# Altium project drive_Project1.PrjPCB
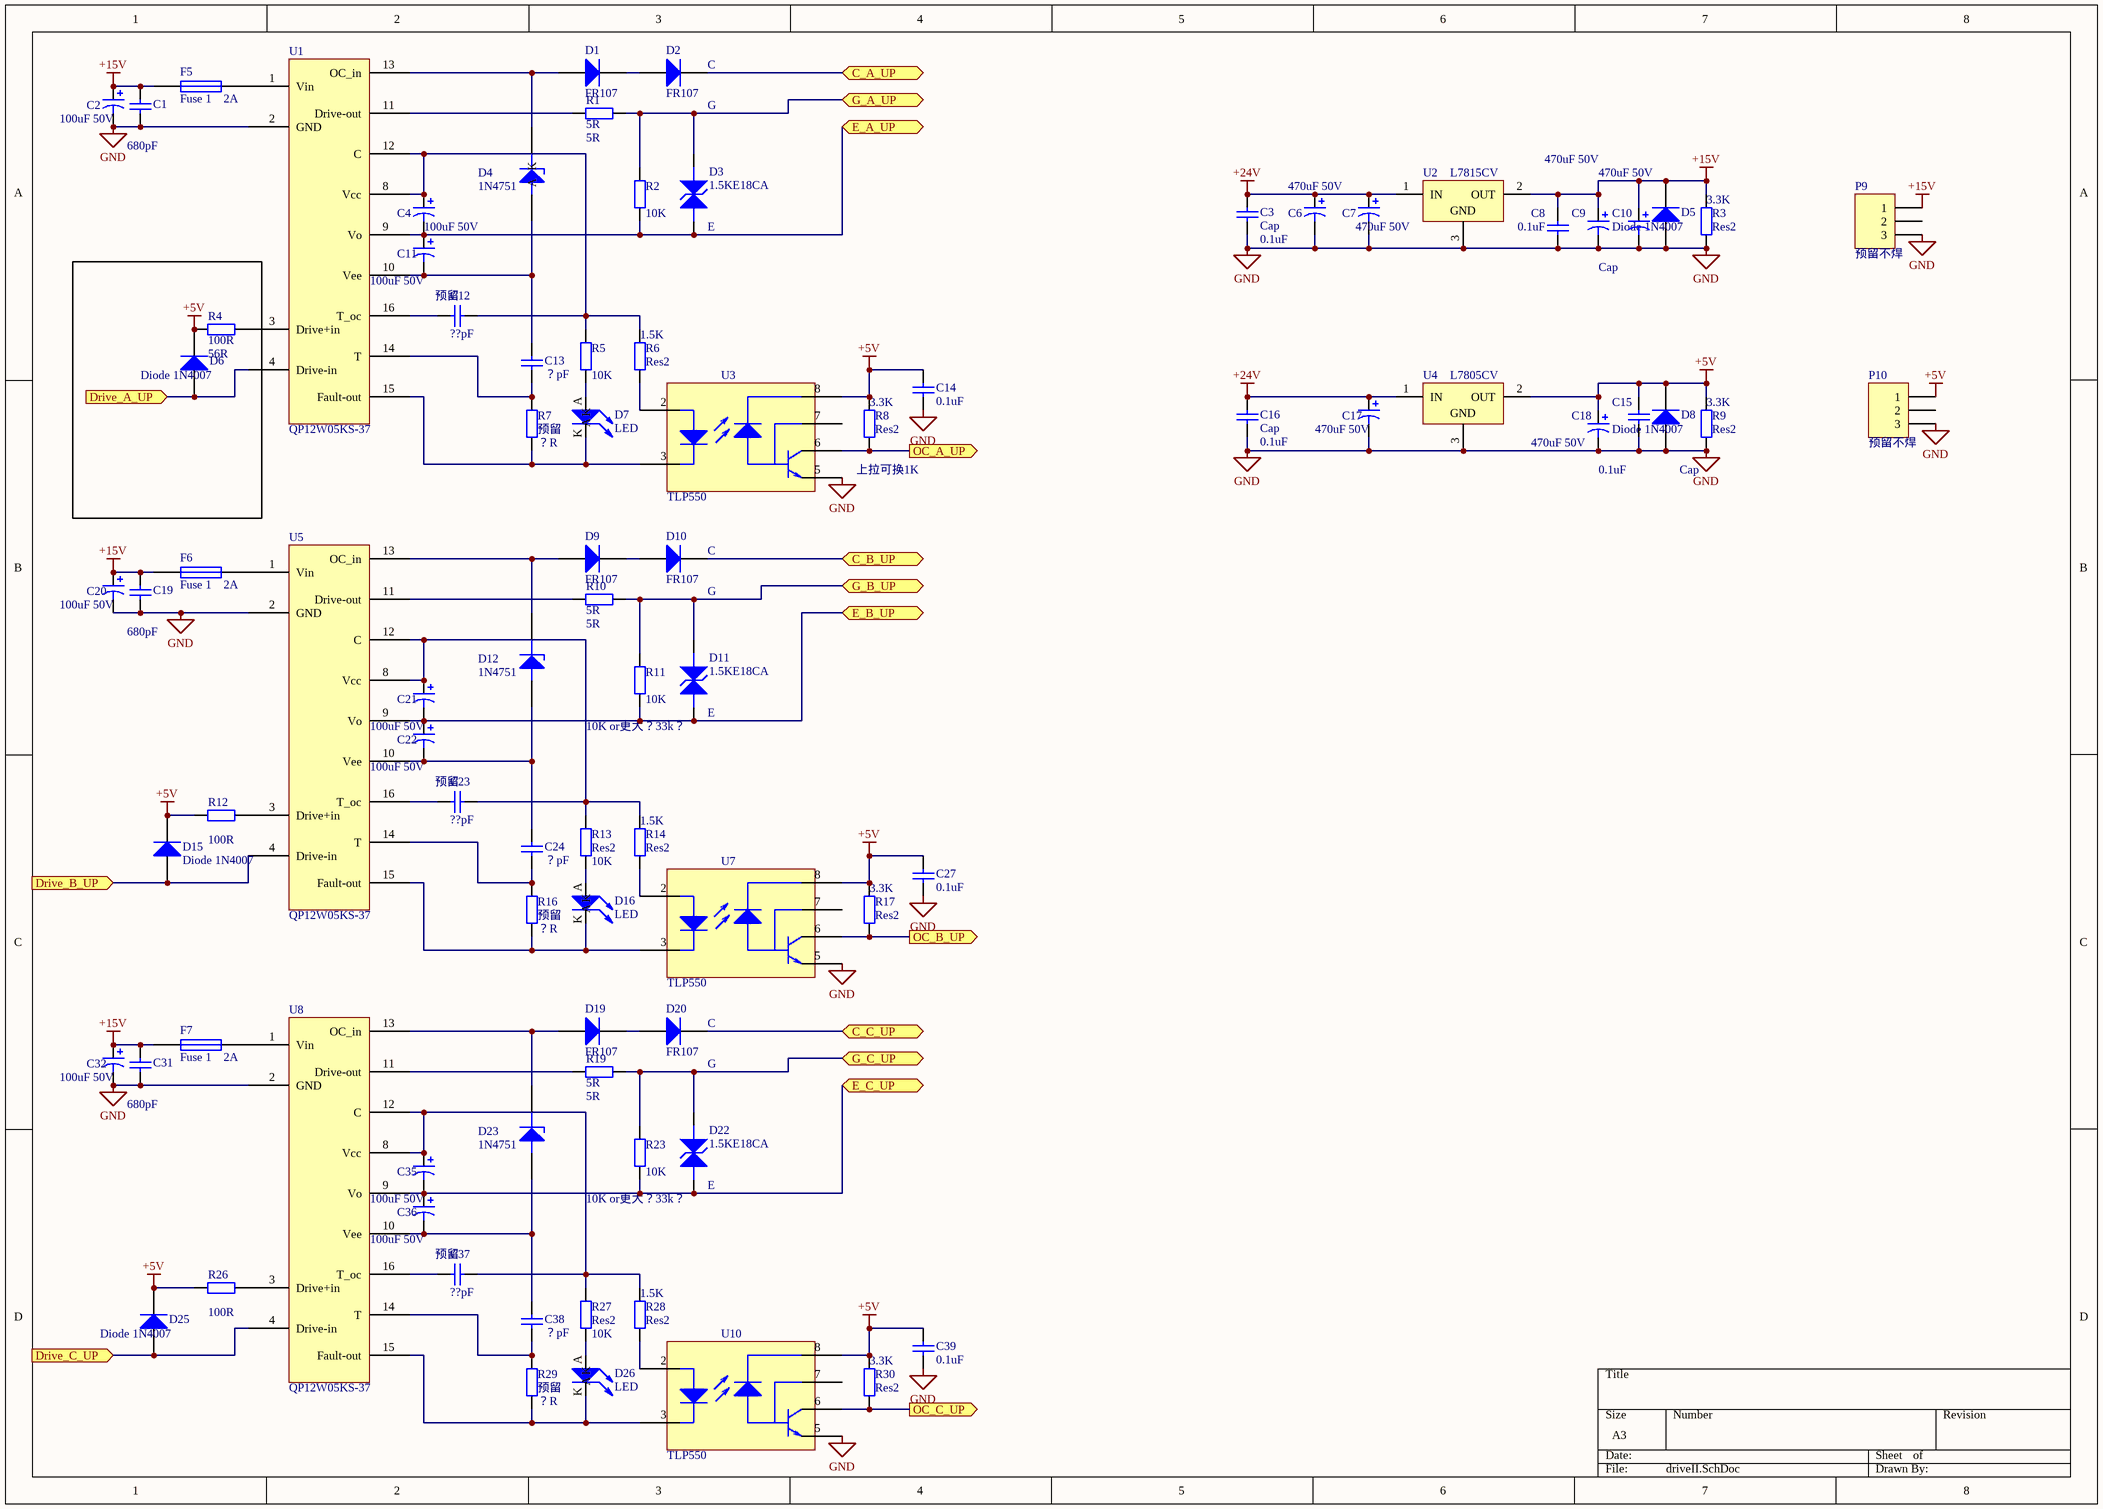
[diagram p0: driveII.SchDoc]
3 sheets, 223 parts. Net scope: flat (ports and power ports of the same name join across sheets).
Board file: PCB2.PcbDoc
Sheets:
  driveII.SchDoc
  driveIII.SchDoc
  main1.SchDoc

## Sheet driveII.SchDoc
size A3

### Parts
C1  value 680pF  [1206]  (hidden comment: Cap)
C2  value 100uF 50V  [电解电容1000uF]  (hidden comment: Cap Pol1)
C3  Cap  value 0.1uF  [1206]
C4  value 100uF 50V  [电解电容1000uF]  (hidden comment: Cap Pol1)
C6  value 470uF 50V  [电解电容470uf]  (hidden comment: Cap Pol1)
C7  value 470uF 50V  [电解电容470uf]  (hidden comment: Cap Pol1)
C8  Cap  value 0.1uF  [1206]
C9  value 470uF 50V  [电解电容470uf]  (hidden comment: Cap Pol1)
C10  value 470uF 50V  [电解电容470uf]  (hidden comment: Cap Pol1)
C11  value 100uF 50V  [电解电容1000uF]  (hidden comment: Cap Pol1)
C12  预留  value ??pF  [1206]
C13  value ？pF  [1206]  (hidden comment: 预留)
C14  value 0.1uF  [1206]  (hidden comment: Cap)
C15  Cap  value 0.1uF  [1206]
C16  Cap  value 0.1uF  [1206]
C17  value 470uF 50V  [电解电容470uf]  (hidden comment: Cap Pol1)
C18  value 470uF 50V  [电解电容470uf]  (hidden comment: Cap Pol1)
C19  value 680pF  [1206]  (hidden comment: Cap)
C20  value 100uF 50V  [电解电容1000uF]  (hidden comment: Cap Pol1)
C21  value 100uF 50V  [电解电容1000uF]  (hidden comment: Cap Pol1)
C22  value 100uF 50V  [电解电容1000uF]  (hidden comment: Cap Pol1)
C23  预留  value ??pF  [1206]
C24  value ？pF  [1206]  (hidden comment: 预留)
C27  value 0.1uF  [1206]  (hidden comment: Cap)
C31  value 680pF  [1206]  (hidden comment: Cap)
C32  value 100uF 50V  [电解电容1000uF]  (hidden comment: Cap Pol1)
C35  value 100uF 50V  [电解电容1000uF]  (hidden comment: Cap Pol1)
C36  value 100uF 50V  [电解电容1000uF]  (hidden comment: Cap Pol1)
C37  预留  value ??pF  [1206]
C38  value ？pF  [1206]  (hidden comment: 预留)
C39  value 0.1uF  [1206]  (hidden comment: Cap)
D1  FR107  [DIODE-0.4]
D2  FR107  [DIODE-0.4]
D3  1.5KE18CA  [AXIAL0.4]
D4  1N4751  [DIODE0.4]
D5  Diode 1N4007  [DIODE0.4]
D6  Diode 1N4007  [DIODE-0.4]
D7  LED  [0805D]
D8  Diode 1N4007  [DIODE0.4]
D9  FR107  [DIODE-0.4]
D10  FR107  [DIODE-0.4]
D11  1.5KE18CA  [AXIAL0.4]
D12  1N4751  [DIODE0.4]
D15  Diode 1N4007  [DIODE-0.4]
D16  LED  [0805D]
D19  FR107  [DIODE-0.4]
D20  FR107  [DIODE-0.4]
D22  1.5KE18CA  [AXIAL0.4]
D23  1N4751  [DIODE0.4]
D25  Diode 1N4007  [DIODE-0.4]
D26  LED  [0805D]
F5  Fuse 1　2A  [CAPR5-4X5]
F6  Fuse 1　2A  [CAPR5-4X5]
F7  Fuse 1　2A  [CAPR5-4X5]
P9  预留不焊  [PHENOX-3]
P10  预留不焊  [PHENOX-3]
R1  5R  [AXIAL0.6]
R2  10K  [AXIAL0.4]
R3  Res2  value 3.3K  [AXIAL0.4]
R4  100R  value 56R  [AXIAL-0.6]
R5  value 10K  [1206]  (hidden comment: Res2)
R6  Res2  value 1.5K  [1206]
R7  预留  value ？R  [1206]
R8  Res2  value 3.3K  [1206]
R9  Res2  value 3.3K  [AXIAL0.4]
R10  5R  [AXIAL0.6]
R11  10K or更大？33k？  value 10K  [AXIAL0.4]
R12  value 100R  [AXIAL-0.6]  (hidden comment: Res2)
R13  Res2  value 10K  [1206]
R14  Res2  value 1.5K  [1206]
R16  预留  value ？R  [1206]
R17  Res2  value 3.3K  [1206]
R19  5R  [AXIAL0.6]
R23  10K or更大？33k？  value 10K  [AXIAL0.4]
R26  value 100R  [AXIAL-0.6]  (hidden comment: Res2)
R27  Res2  value 10K  [1206]
R28  Res2  value 1.5K  [1206]
R29  预留  value ？R  [1206]
R30  Res2  value 3.3K  [1206]
U1  QP12W05KS-37  [QP12W05KS37]
U2  L7815CV  [TO220ABN]
U3  TLP550  [DIP8]
U4  L7805CV  [TO220ABN]
U5  QP12W05KS-37  [QP12W05KS37]
U7  TLP550  [DIP8]
U8  QP12W05KS-37  [QP12W05KS37]
U10  TLP550  [DIP8]

### Ports
C_A_UP, C_B_UP, C_C_UP, Drive_A_UP (in), Drive_B_UP (in), Drive_C_UP (in), E_A_UP, E_B_UP, E_C_UP, G_A_UP, G_B_UP, G_C_UP, OC_A_UP (out), OC_B_UP (out), OC_C_UP (out)

### Nets
+5V: C14.1 C15.2 C18.1 C27.1 C39.1 D6.2(K) D8.K D15.2(K) D25.2(K) P10.1 R4.2 R8.2 R9.2 R12.2 R17.2 R26.2 R30.2 U3.8 U4.2(OUT) U7.8 U10.8
+15V: C1.2 C2.1 C8.2 C9.1 C10.1 C19.2 C20.1 C31.2 C32.1 D5.K F5.1 F6.1 F7.1 P9.1 R3.2 U2.2(OUT)
+24V: C3.2 C6.1 C7.1 C16.2 C17.1 U2.1(IN) U4.1(IN)
GND: C1.1 C2.2 C3.1 C6.2 C7.2 C8.1 C9.2 C10.2 C14.2 C15.1 C16.1 C17.2 C18.2 C19.1 C20.2 C27.2 C31.1 C32.2 C39.2 D5.A D8.A P9.3 P10.3 R3.1 R9.1 U1.2(GND) U2.3(GND) U3.5 U4.3(GND) U5.2(GND) U7.5 U8.2(GND) U10.5
NetC4_1: C4.1 C12.1 R5.2 R6.2 U1.8(Vcc) U1.12(C)
NetC4_2: C4.2 C11.1 D3.1 R2.1 U1.9(Vo) ; port E_A_UP
NetC11_2: C11.2 C13.1 D4.A U1.10(Vee)
NetC12_2: C12.2 U1.16(T_oc)
NetC13_2: C13.2 R7.2 U1.14(T)
NetC21_1: C21.1 C23.1 R13.2 R14.2 U5.8(Vcc) U5.12(C)
NetC21_2: C21.2 C22.1 D11.1 R11.1 U5.9(Vo) ; port E_B_UP
NetC22_2: C22.2 C24.1 D12.A U5.10(Vee)
NetC23_2: C23.2 U5.16(T_oc)
NetC24_2: C24.2 R16.2 U5.14(T)
NetC35_1: C35.1 C37.1 R27.2 R28.2 U8.8(Vcc) U8.12(C)
NetC35_2: C35.2 C36.1 D22.1 R23.1 U8.9(Vo) ; port E_C_UP
NetC36_2: C36.2 C38.1 D23.A U8.10(Vee)
NetC37_2: C37.2 U8.16(T_oc)
NetC38_2: C38.2 R29.2 U8.14(T)
NetC63_2: D2.2(K) D10.2(K) D20.2(K) ; port C_A_UP, port C_B_UP, port C_C_UP
NetCON1_2: D6.1(A) U1.4(Drive-in) ; port Drive_A_UP
NetCON1_6: R8.1 U3.6 ; port OC_A_UP
NetCON1_8: R17.1 U7.6 ; port OC_B_UP
NetCON1_12: R30.1 U10.6 ; port OC_C_UP
NetCON1_18: D15.1(A) U5.4(Drive-in) ; port Drive_B_UP
NetCON1_26: D25.1(A) U8.4(Drive-in) ; port Drive_C_UP
NetD1_1: D1.1(A) D4.K U1.13(OC_in)
NetD1_2: D1.2(K) D2.1(A)
NetD3_2: D3.2 R1.2 R2.2 ; port G_A_UP
NetD7_A: D7.A R5.1
NetD7_K: D7.K R7.1 U1.15(Fault-out) U3.3
NetD9_1: D9.1(A) D12.K U5.13(OC_in)
NetD9_2: D9.2(K) D10.1(A)
NetD11_2: D11.2 R10.2 R11.2 ; port G_B_UP
NetD16_A: D16.A R13.1
NetD16_K: D16.K R16.1 U5.15(Fault-out) U7.3
NetD19_1: D19.1(A) D23.K U8.13(OC_in)
NetD19_2: D19.2(K) D20.1(A)
NetD22_2: D22.2 R19.2 R23.2 ; port G_C_UP
NetD26_A: D26.A R27.1
NetD26_K: D26.K R29.1 U8.15(Fault-out) U10.3
NetF5_2: F5.2 U1.1(Vin)
NetF6_2: F6.2 U5.1(Vin)
NetF7_2: F7.2 U8.1(Vin)
NetR1_1: R1.1 U1.11(Drive-out)
NetR4_1: R4.1 U1.3(Drive+in)
NetR6_1: R6.1 U3.2
NetR10_1: R10.1 U5.11(Drive-out)
NetR12_1: R12.1 U5.3(Drive+in)
NetR14_1: R14.1 U7.2
NetR19_1: R19.1 U8.11(Drive-out)
NetR26_1: R26.1 U8.3(Drive+in)
NetR28_1: R28.1 U10.2

Not connected (* = marked no-connect by the designer): P9 2; P10 2; U3 7; U7 7; U10 7

### Notes on the sheet
- (near D2) C
- G
- (near D3) E
- (near R8) 上拉可换1K
- (near D10) C
- (near D11) E
- (near D20) C
- (near D22) E

### Library data of the parts
C1 C3 C8 C13-C16 C19 C24 C27 C31 C38 C39 = Cap: Capacitor; Published: 8-Jun-2000; LatestRevisionDate: 17-Jul-2002; LatestRevisionNote: Re-released for DXP Platform.; PackageReference: RAD-0.3; Publisher: Altium Limited
C2 C4 C6 C7 C9-C11 C17 C18 C20-C22 C32 C35 C36 = Cap Pol1: Polarized Capacitor (Radial); Published: 8-Jun-2000; LatestRevisionDate: 17-Jul-2002; LatestRevisionNote: Re-released for DXP Platform.; PackageReference: RB7.6-15; Publisher: Altium Limited
C12 C23 C37 = Cap: Published: 8-Jun-2000; LatestRevisionDate: 17-Jul-2002; LatestRevisionNote: Re-released for DXP Platform.; PackageReference: RAD-0.3; Publisher: Altium Limited
D1 D2 D5 D6 D8-D10 D15 D19 D20 D25 = Diode 1N4148: High Conductance Fast Diode; Published: 8-Jun-2000; LatestRevisionDate: 17-Jul-2002; LatestRevisionNote: Re-released for DXP Platform.; DatasheetVersion: 1997; PackageReference: DO-35; Publisher: Altium Limited; Code_JEDEC: DO-204-AH; ComponentLink1Description: Manufacturer Link; ComponentLink1URL: http://www.fairchildsemi.com/; ComponentLink2Description: Datasheet; ComponentLink2URL: http://www.fairchildsemi.com/ds/1N%2F1N4148.pdf
D3 D11 D22 = D-SMBJ5.0CA: TVS 18V
D4 D12 D23 = ZENER1: Zener Diode 30V
D7 D16 D26 = DIODE1
F5-F7 = Fuse 1: Fuse; Published: 8-Jun-2000; LatestRevisionDate: 17-Jul-2002; LatestRevisionNote: Re-released for DXP Platform.; PackageReference: PIN-W2/E2.8; Publisher: Altium Limited
P9 P10 = Header 3: Header, 3-Pin; LatestRevisionDate: 17-Jul-2002; LatestRevisionNote: Re-released for DXP Platform.; Publisher: Altium Limited
R1-R14 R16 R17 R19 R23 R26-R30 = Res2: Resistor; Published: 8-Jun-2000; LatestRevisionDate: 17-Jul-2002; LatestRevisionNote: Re-released for DXP Platform.; PackageReference: AXIAL-0.4; Publisher: Altium Limited
  R1 R10 R19: Value: 5R
  R2: Value: 10K
U2 U4 = L7815CV: Positive Voltage Regulator; Note: Tab is connected to pin 3 (GND).; Published: 24-Aug-2001; LatestRevisionDate: 17-Jul-2002; LatestRevisionNote: Re-released for DXP Platform.; DatasheetVersion: Dec-1998; PackageVersion: Jun-1998; PackageReference: TO220ABN; Publisher: Altium Limited; PackageDescription: TO, Thru-Hole, Vertical, Heatsink Mounted; 3 In-Line Leads; Pitch 2.54 mm; Pin sequence 1, 3, 2; ComponentLink1Description: Manufacturer Link; ComponentLink1URL: http://www.st.com/
U3 U7 U10 = HCPL4053

## Sheet driveIII.SchDoc
size A3
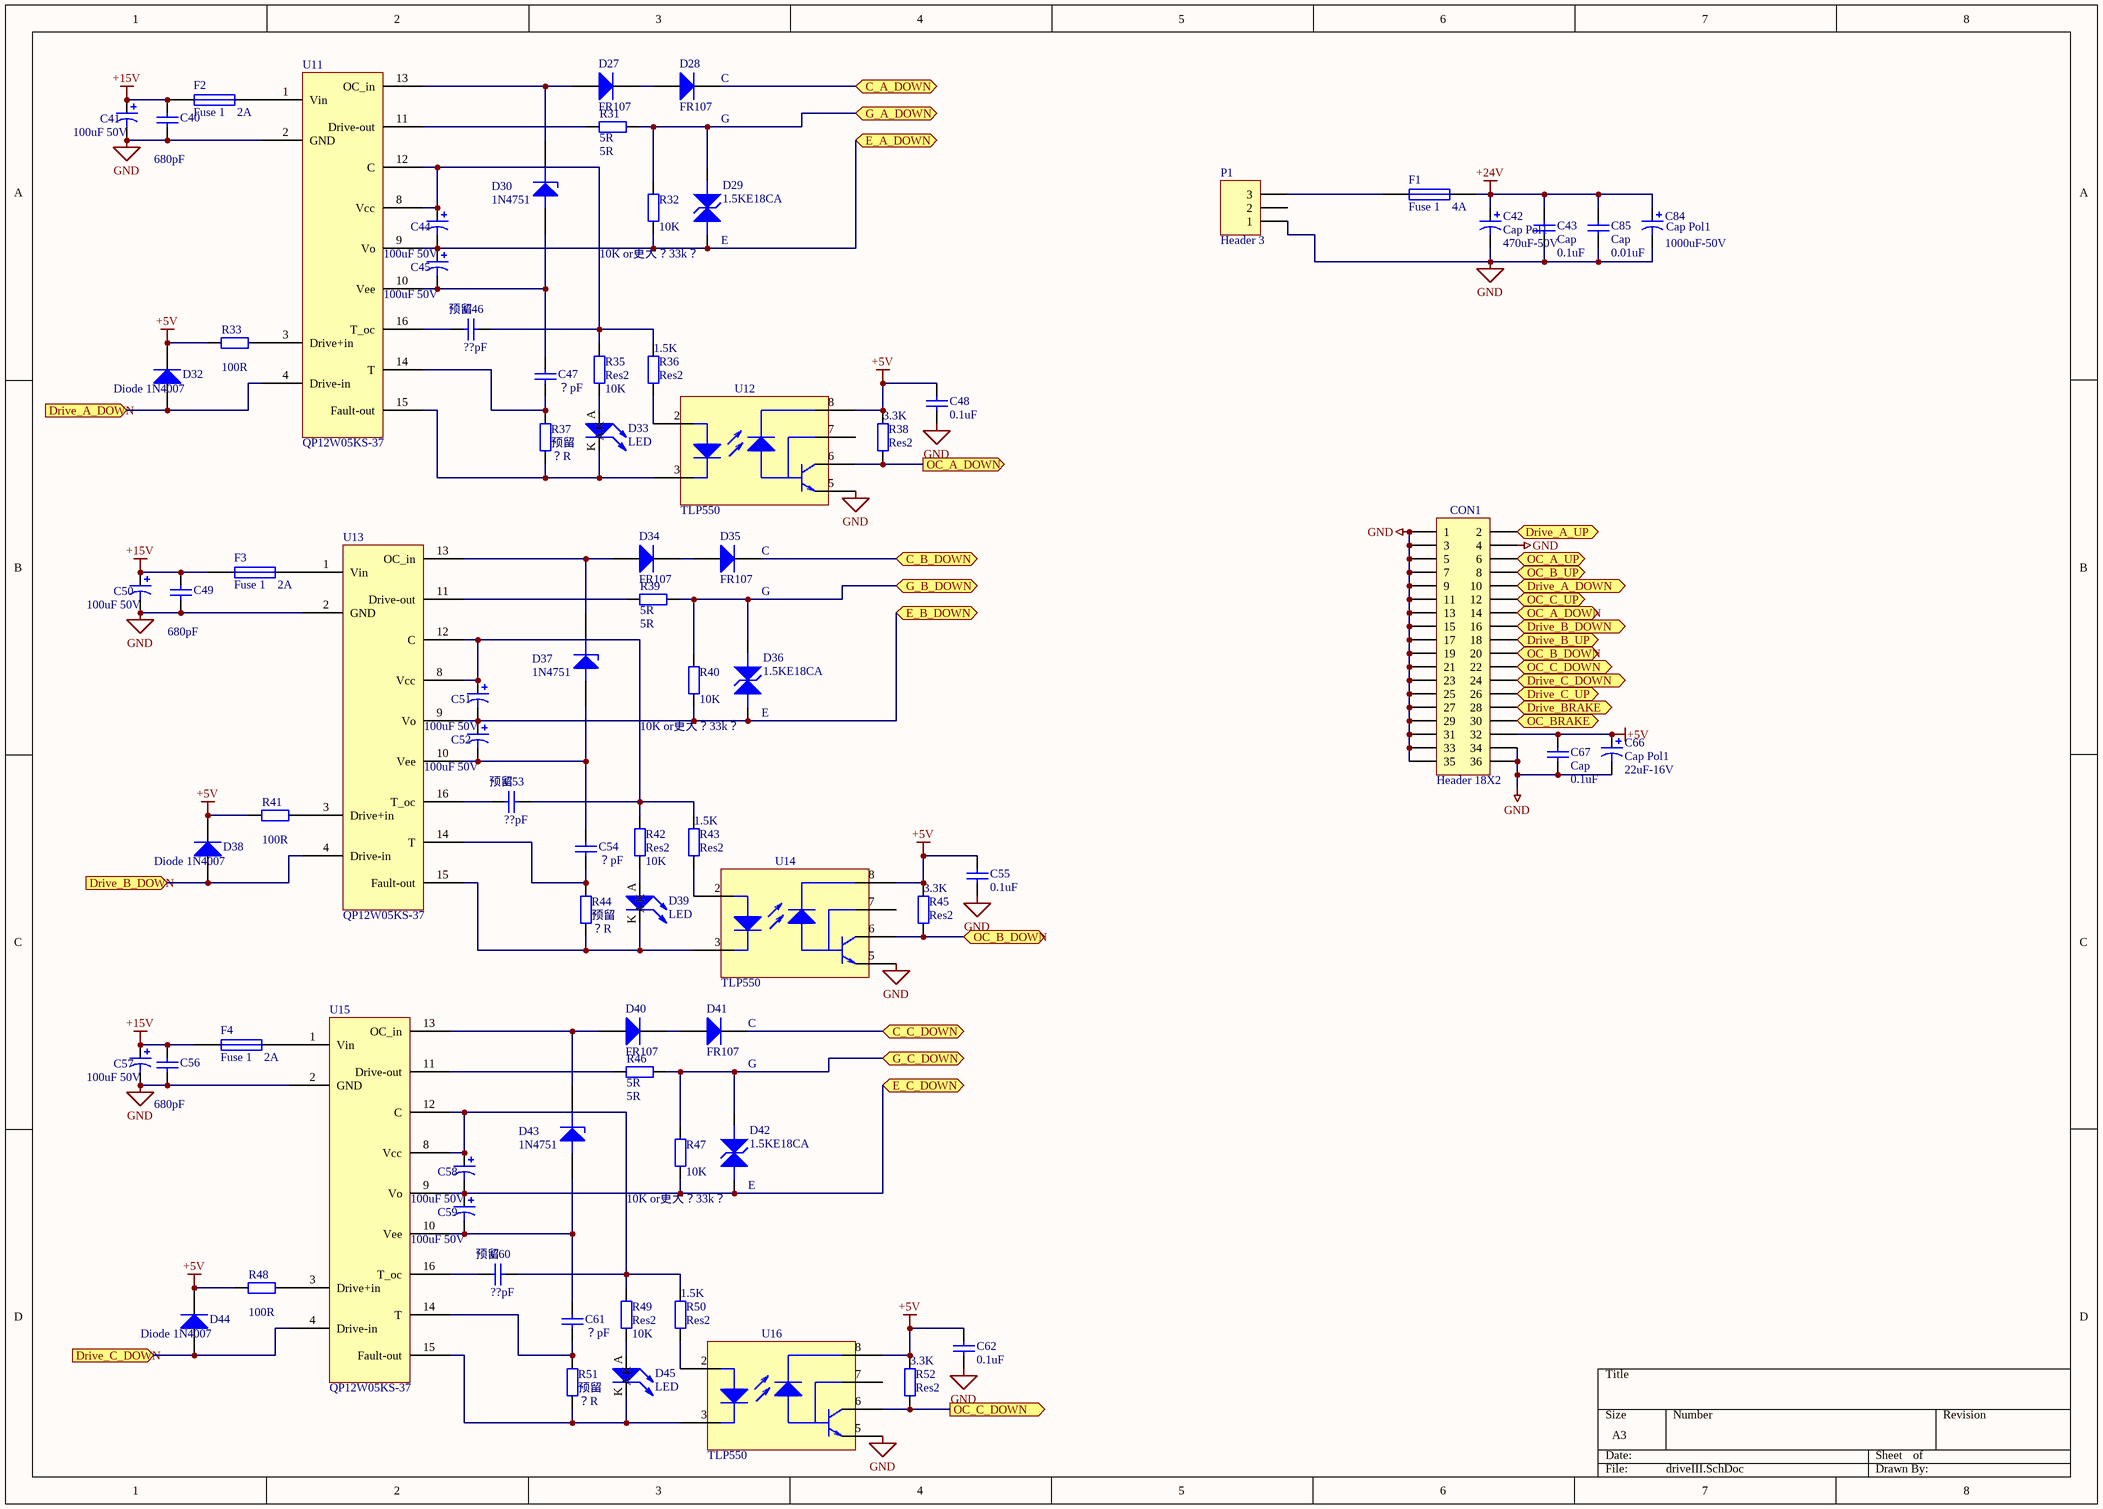
[diagram p1: driveIII.SchDoc]

### Parts
C40  value 680pF  [1206]  (hidden comment: Cap)
C41  value 100uF 50V  [电解电容1000uF]  (hidden comment: Cap Pol1)
C42  Cap Pol1  value 470uF-50V  [电解电容470uf]
C43  Cap  value 0.1uF  [1206]
C44  value 100uF 50V  [电解电容1000uF]  (hidden comment: Cap Pol1)
C45  value 100uF 50V  [电解电容1000uF]  (hidden comment: Cap Pol1)
C46  预留  value ??pF  [1206]
C47  value ？pF  [1206]  (hidden comment: 预留)
C48  value 0.1uF  [1206]  (hidden comment: Cap)
C49  value 680pF  [1206]  (hidden comment: Cap)
C50  value 100uF 50V  [电解电容1000uF]  (hidden comment: Cap Pol1)
C51  value 100uF 50V  [电解电容1000uF]  (hidden comment: Cap Pol1)
C52  value 100uF 50V  [电解电容1000uF]  (hidden comment: Cap Pol1)
C53  预留  value ??pF  [1206]
C54  value ？pF  [1206]  (hidden comment: 预留)
C55  value 0.1uF  [1206]  (hidden comment: Cap)
C56  value 680pF  [1206]  (hidden comment: Cap)
C57  value 100uF 50V  [电解电容1000uF]  (hidden comment: Cap Pol1)
C58  value 100uF 50V  [电解电容1000uF]  (hidden comment: Cap Pol1)
C59  value 100uF 50V  [电解电容1000uF]  (hidden comment: Cap Pol1)
C60  预留  value ??pF  [1206]
C61  value ？pF  [1206]  (hidden comment: 预留)
C62  value 0.1uF  [1206]  (hidden comment: Cap)
C66  Cap Pol1  value 22uF-16V  [7343]
C67  Cap  value 0.1uF  [1206]
C84  Cap Pol1  value 1000uF-50V  [电解电容1000uF]
C85  Cap  value 0.01uF  [1206]
CON1  Header 18X2  [HDR2X18]
D27  FR107  [DIODE-0.4]
D28  FR107  [DIODE-0.4]
D29  1.5KE18CA  [AXIAL0.4]
D30  1N4751  [DIODE0.4]
D32  Diode 1N4007  [DIODE-0.4]
D33  LED  [0805D]
D34  FR107  [DIODE-0.4]
D35  FR107  [DIODE-0.4]
D36  1.5KE18CA  [AXIAL0.4]
D37  1N4751  [DIODE0.4]
D38  Diode 1N4007  [DIODE-0.4]
D39  LED  [0805D]
D40  FR107  [DIODE-0.4]
D41  FR107  [DIODE-0.4]
D42  1.5KE18CA  [AXIAL0.4]
D43  1N4751  [DIODE0.4]
D44  Diode 1N4007  [DIODE-0.4]
D45  LED  [0805D]
F1  Fuse 1　4A  [FUSE]
F2  Fuse 1　2A  [CAPR5-4X5]
F3  Fuse 1　2A  [CAPR5-4X5]
F4  Fuse 1　2A  [CAPR5-4X5]
P1  Header 3  [PHENOX-3]
R31  5R  [AXIAL0.6]
R32  10K or更大？33k？  value 10K  [AXIAL0.4]
R33  value 100R  [AXIAL-0.6]  (hidden comment: Res2)
R35  Res2  value 10K  [1206]
R36  Res2  value 1.5K  [1206]
R37  预留  value ？R  [1206]
R38  Res2  value 3.3K  [1206]
R39  5R  [AXIAL0.6]
R40  10K or更大？33k？  value 10K  [AXIAL0.4]
R41  value 100R  [AXIAL-0.6]  (hidden comment: Res2)
R42  Res2  value 10K  [1206]
R43  Res2  value 1.5K  [1206]
R44  预留  value ？R  [1206]
R45  Res2  value 3.3K  [1206]
R46  5R  [AXIAL0.6]
R47  10K or更大？33k？  value 10K  [AXIAL0.4]
R48  value 100R  [AXIAL-0.6]  (hidden comment: Res2)
R49  Res2  value 10K  [1206]
R50  Res2  value 1.5K  [1206]
R51  预留  value ？R  [1206]
R52  Res2  value 3.3K  [1206]
U11  QP12W05KS-37  [QP12W05KS37]
U12  TLP550  [DIP8]
U13  QP12W05KS-37  [QP12W05KS37]
U14  TLP550  [DIP8]
U15  QP12W05KS-37  [QP12W05KS37]
U16  TLP550  [DIP8]

### Ports
C_A_DOWN, C_B_DOWN, C_C_DOWN, Drive_A_DOWN (in), Drive_A_DOWN (out), Drive_A_UP (out), Drive_B_DOWN (in), Drive_B_DOWN (out), Drive_B_UP (out), Drive_BRAKE (out), Drive_C_DOWN (in), Drive_C_DOWN (out), Drive_C_UP (out), E_A_DOWN, E_B_DOWN, E_C_DOWN, G_A_DOWN, G_B_DOWN, G_C_DOWN, OC_A_DOWN (in), OC_A_DOWN (out), OC_A_UP (in), OC_B_DOWN, OC_B_UP (in), OC_BRAKE (in), OC_C_DOWN (in), OC_C_DOWN (out), OC_C_UP (in)

### Nets
+5V: C48.1 C55.1 C62.1 C66.1 C67.2 CON1.32 D32.2(K) D38.2(K) D44.2(K) R33.2 R38.2 R41.2 R45.2 R48.2 R52.2 U12.8 U14.8 U16.8
+15V: C40.2 C41.1 C49.2 C50.1 C56.2 C57.1 F2.1 F3.1 F4.1
+24V: C42.1 C43.2 C84.1 C85.2 F1.2
GND: C40.1 C41.2 C42.2 C43.1 C48.2 C49.1 C50.2 C55.2 C56.1 C57.2 C62.2 C66.2 C67.1 C84.2 C85.1 CON1.1 CON1.3 CON1.4 CON1.5 CON1.7 CON1.9 CON1.11 CON1.13 CON1.15 CON1.17 CON1.19 CON1.21 CON1.23 CON1.25 CON1.27 CON1.29 CON1.31 CON1.33 CON1.34 CON1.35 CON1.36 P1.1 U11.2(GND) U12.5 U13.2(GND) U14.5 U15.2(GND) U16.5
NetC44_1: C44.1 C46.1 R35.2 R36.2 U11.8(Vcc) U11.12(C)
NetC44_2: C44.2 C45.1 C51.2 C52.1 C58.2 C59.1 D29.1 D36.1 D42.1 R32.1 R40.1 R47.1 U11.9(Vo) U13.9(Vo) U15.9(Vo) ; port E_A_DOWN, port E_B_DOWN, port E_C_DOWN
NetC45_2: C45.2 C47.1 D30.A U11.10(Vee)
NetC46_2: C46.2 U11.16(T_oc)
NetC47_2: C47.2 R37.2 U11.14(T)
NetC51_1: C51.1 C53.1 R42.2 R43.2 U13.8(Vcc) U13.12(C)
NetC52_2: C52.2 C54.1 D37.A U13.10(Vee)
NetC53_2: C53.2 U13.16(T_oc)
NetC54_2: C54.2 R44.2 U13.14(T)
NetC58_1: C58.1 C60.1 R49.2 R50.2 U15.8(Vcc) U15.12(C)
NetC59_2: C59.2 C61.1 D43.A U15.10(Vee)
NetC60_2: C60.2 U15.16(T_oc)
NetC61_2: C61.2 R51.2 U15.14(T)
NetCON1_2: CON1.2 ; port Drive_A_UP
NetCON1_6: CON1.6 ; port OC_A_UP
NetCON1_8: CON1.8 ; port OC_B_UP
NetCON1_10: CON1.10 D32.1(A) U11.4(Drive-in) ; port Drive_A_DOWN
NetCON1_12: CON1.12 ; port OC_C_UP
NetCON1_14: CON1.14 R38.1 U12.6 ; port OC_A_DOWN
NetCON1_16: CON1.16 D38.1(A) U13.4(Drive-in) ; port Drive_B_DOWN
NetCON1_18: CON1.18 ; port Drive_B_UP
NetCON1_20: CON1.20 R45.1 U14.6 ; port OC_B_DOWN
NetCON1_22: CON1.22 R52.1 U16.6 ; port OC_C_DOWN
NetCON1_24: CON1.24 D44.1(A) U15.4(Drive-in) ; port Drive_C_DOWN
NetCON1_26: CON1.26 ; port Drive_C_UP
NetCON1_28: CON1.28 ; port Drive_BRAKE
NetCON1_30: CON1.30 ; port OC_BRAKE
NetD27_1: D27.1(A) D30.K U11.13(OC_in)
NetD27_2: D27.2(K) D28.1(A)
NetD28_2: D28.2(K) ; port C_A_DOWN
NetD29_2: D29.2 R31.2 R32.2 ; port G_A_DOWN
NetD33_A: D33.A R35.1
NetD33_K: D33.K R37.1 U11.15(Fault-out) U12.3
NetD34_1: D34.1(A) D37.K U13.13(OC_in)
NetD34_2: D34.2(K) D35.1(A)
NetD35_2: D35.2(K) ; port C_B_DOWN
NetD36_2: D36.2 R39.2 R40.2 ; port G_B_DOWN
NetD39_A: D39.A R42.1
NetD39_K: D39.K R44.1 U13.15(Fault-out) U14.3
NetD40_1: D40.1(A) D43.K U15.13(OC_in)
NetD40_2: D40.2(K) D41.1(A)
NetD41_2: D41.2(K) ; port C_C_DOWN
NetD42_2: D42.2 R46.2 R47.2 ; port G_C_DOWN
NetD45_A: D45.A R49.1
NetD45_K: D45.K R51.1 U15.15(Fault-out) U16.3
NetF1_1: F1.1 P1.3
NetF2_2: F2.2 U11.1(Vin)
NetF3_2: F3.2 U13.1(Vin)
NetF4_2: F4.2 U15.1(Vin)
NetR31_1: R31.1 U11.11(Drive-out)
NetR33_1: R33.1 U11.3(Drive+in)
NetR36_1: R36.1 U12.2
NetR39_1: R39.1 U13.11(Drive-out)
NetR41_1: R41.1 U13.3(Drive+in)
NetR43_1: R43.1 U14.2
NetR46_1: R46.1 U15.11(Drive-out)
NetR48_1: R48.1 U15.3(Drive+in)
NetR50_1: R50.1 U16.2

Not connected (* = marked no-connect by the designer): P1 2; U12 7; U14 7; U16 7

### Notes on the sheet
- (near D28) C
- G
- (near D29) E
- (near D35) C
- (near D36) E
- (near D41) C
- (near D42) E

### Library data of the parts
C40 C43 C47-C49 C54-C56 C61 C62 C67 C85 = Cap: Capacitor; Published: 8-Jun-2000; LatestRevisionDate: 17-Jul-2002; LatestRevisionNote: Re-released for DXP Platform.; PackageReference: RAD-0.3; Publisher: Altium Limited
C41 C42 C44 C45 C50-C52 C57-C59 C66 C84 = Cap Pol1: Polarized Capacitor (Radial); Published: 8-Jun-2000; LatestRevisionDate: 17-Jul-2002; LatestRevisionNote: Re-released for DXP Platform.; PackageReference: RB7.6-15; Publisher: Altium Limited
C46 C53 C60 = Cap: Published: 8-Jun-2000; LatestRevisionDate: 17-Jul-2002; LatestRevisionNote: Re-released for DXP Platform.; PackageReference: RAD-0.3; Publisher: Altium Limited
CON1 = Header 18X2: Header, 18-Pin, Dual row; LatestRevisionDate: 17-Jul-2002; LatestRevisionNote: Re-released for DXP Platform.; Publisher: Altium Limited
D27 D28 D32 D34 D35 D38 D40 D41 D44 = Diode 1N4148: High Conductance Fast Diode; Published: 8-Jun-2000; LatestRevisionDate: 17-Jul-2002; LatestRevisionNote: Re-released for DXP Platform.; DatasheetVersion: 1997; PackageReference: DO-35; Publisher: Altium Limited; Code_JEDEC: DO-204-AH; ComponentLink1Description: Manufacturer Link; ComponentLink1URL: http://www.fairchildsemi.com/; ComponentLink2Description: Datasheet; ComponentLink2URL: http://www.fairchildsemi.com/ds/1N%2F1N4148.pdf
D29 D36 D42 = D-SMBJ5.0CA: TVS 18V
D30 D37 D43 = ZENER1: Zener Diode 30V
D33 D39 D45 = DIODE1
F1-F4 = Fuse 1: Fuse; Published: 8-Jun-2000; LatestRevisionDate: 17-Jul-2002; LatestRevisionNote: Re-released for DXP Platform.; PackageReference: PIN-W2/E2.8; Publisher: Altium Limited
P1 = Header 3: Header, 3-Pin; LatestRevisionDate: 17-Jul-2002; LatestRevisionNote: Re-released for DXP Platform.; Publisher: Altium Limited
R31-R33 R35-R52 = Res2: Resistor; Published: 8-Jun-2000; LatestRevisionDate: 17-Jul-2002; LatestRevisionNote: Re-released for DXP Platform.; PackageReference: AXIAL-0.4; Publisher: Altium Limited
  R31 R39 R46: Value: 5R
U12 U14 U16 = HCPL4053

## Sheet main1.SchDoc
size A3
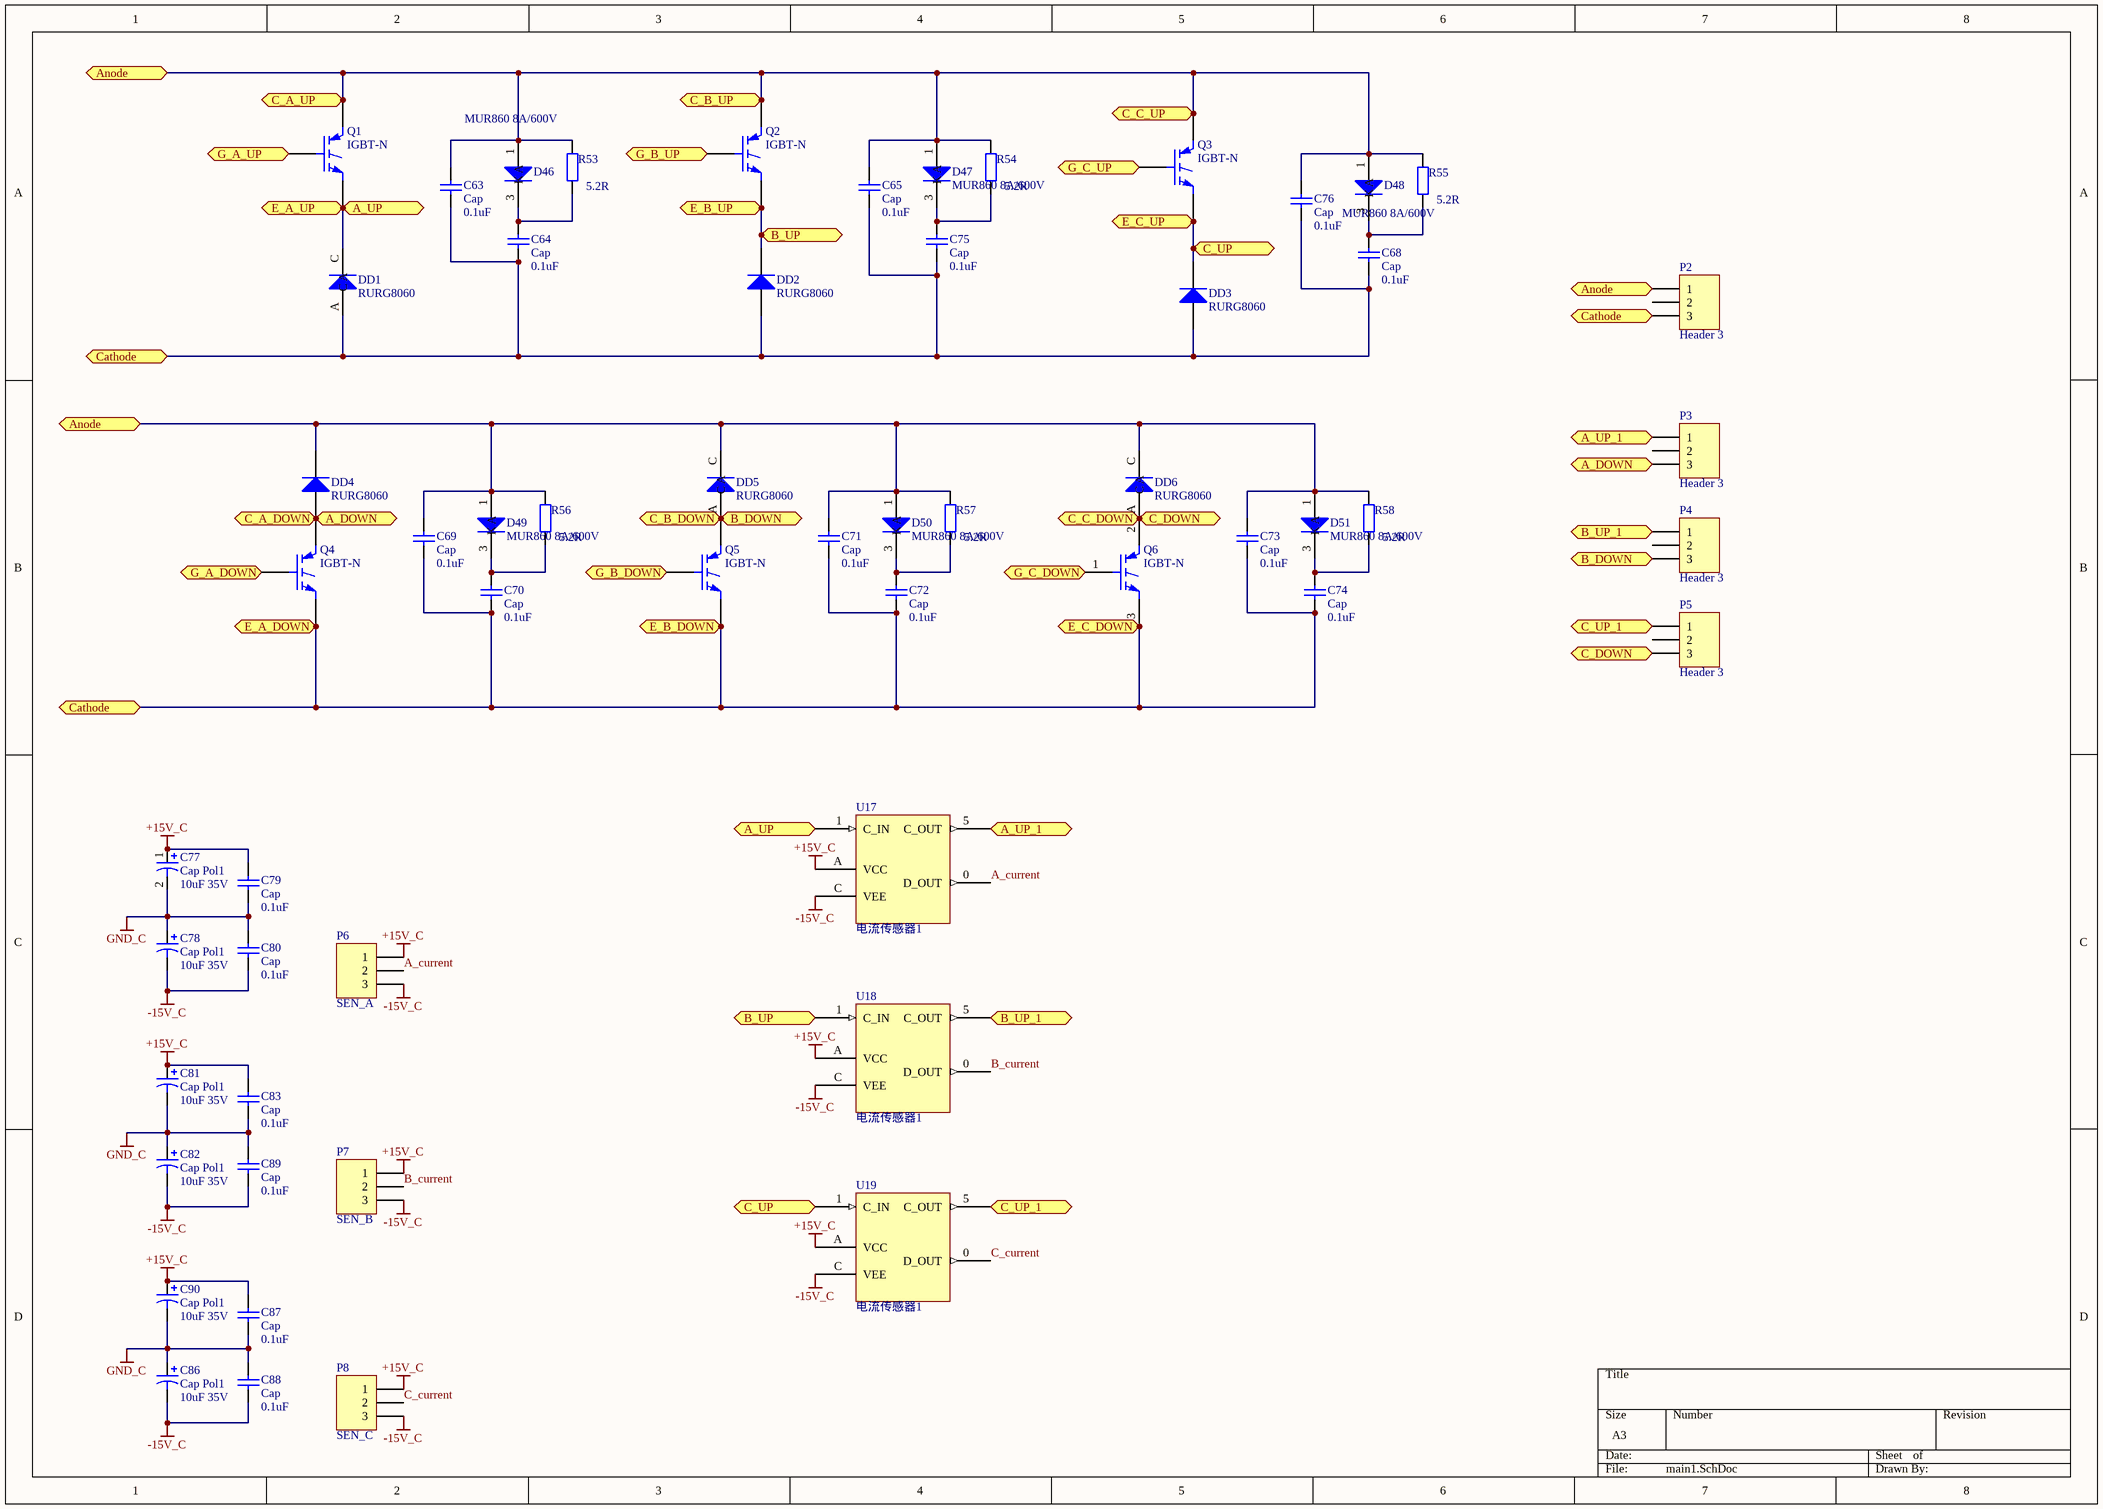
[diagram p2: main1.SchDoc]

### Parts
C63  Cap  value 0.1uF  [无感电容15*6]
C64  Cap  value 0.1uF  [无感电容15*6]
C65  Cap  value 0.1uF  [无感电容15*6]
C68  Cap  value 0.1uF  [无感电容15*6]
C69  Cap  value 0.1uF  [无感电容15*6]
C70  Cap  value 0.1uF  [无感电容15*6]
C71  Cap  value 0.1uF  [无感电容15*6]
C72  Cap  value 0.1uF  [无感电容15*6]
C73  Cap  value 0.1uF  [无感电容15*6]
C74  Cap  value 0.1uF  [无感电容15*6]
C75  Cap  value 0.1uF  [无感电容15*6]
C76  Cap  value 0.1uF  [无感电容15*6]
C77  Cap Pol1  value 10uF 35V  [1206]
C78  Cap Pol1  value 10uF 35V  [1206]
C79  Cap  value 0.1uF  [1206]
C80  Cap  value 0.1uF  [1206]
C81  Cap Pol1  value 10uF 35V  [1206]
C82  Cap Pol1  value 10uF 35V  [1206]
C83  Cap  value 0.1uF  [1206]
C86  Cap Pol1  value 10uF 35V  [1206]
C87  Cap  value 0.1uF  [1206]
C88  Cap  value 0.1uF  [1206]
C89  Cap  value 0.1uF  [1206]
C90  Cap Pol1  value 10uF 35V  [1206]
D46  MUR860 8A/600V  [TO-220_SANRE]
D47  MUR860 8A/600V  [TO-220_SANRE]
D48  MUR860 8A/600V  [TO-220_SANRE]
D49  MUR860 8A/600V  [TO-220_SANRE]
D50  MUR860 8A/600V  [TO-220_SANRE]
D51  MUR860 8A/600V  [TO-220_SANRE]
DD1  RURG8060  [TO247dio]
DD2  RURG8060  [TO247dio]
DD3  RURG8060  [TO247dio]
DD4  RURG8060  [TO247dio]
DD5  RURG8060  [TO247dio]
DD6  RURG8060  [TO247dio]
P2  Header 3  [端子9.5mm-3]
P3  Header 3  [端子9.5mm-3]
P4  Header 3  [端子9.5mm-3]
P5  Header 3  [端子9.5mm-3]
P6  SEN_A  [PHENOX-3]
P7  SEN_B  [PHENOX-3]
P8  SEN_C  [PHENOX-3]
Q1  IGBT-N  [TO247]
Q2  IGBT-N  [TO247]
Q3  IGBT-N  [TO247]
Q4  IGBT-N  [TO247]
Q5  IGBT-N  [TO247]
Q6  IGBT-N  [TO247]
R53  5.2R  [水泥电阻22*9.5]
R54  5.2R  [水泥电阻22*9.5]
R55  5.2R  [水泥电阻22*9.5]
R56  5.2R  [水泥电阻22*9.5]
R57  5.2R  [水泥电阻22*9.5]
R58  5.2R  [水泥电阻22*9.5]
U17  电流传感器1  [电流传感器1]
U18  电流传感器1  [电流传感器1]
U19  电流传感器1  [电流传感器1]

### Ports
A_DOWN, A_UP, A_UP_1, Anode, B_DOWN, B_UP, B_UP_1, C_A_DOWN, C_A_UP, C_B_DOWN, C_B_UP, C_C_DOWN, C_C_UP, C_DOWN, C_UP, C_UP_1, Cathode, E_A_DOWN, E_A_UP, E_B_DOWN, E_B_UP, E_C_DOWN, E_C_UP, G_A_DOWN, G_A_UP, G_B_DOWN, G_B_UP, G_C_DOWN, G_C_UP

### Nets
+15V_C: C77.1 C79.2 C81.1 C83.2 C87.2 C90.1 P6.1 P7.1 P8.1 U17.A(VCC) U18.A(VCC) U19.A(VCC)
-15V_C: C78.2 C80.1 C82.2 C86.2 C88.1 C89.1 P6.3 P7.3 P8.3 U17.C(VEE) U18.C(VEE) U19.C(VEE)
GND_C: C77.2 C78.1 C79.1 C80.2 C81.2 C82.1 C83.1 C86.1 C87.1 C88.2 C89.2 C90.2
A_current: P6.2 U17.0(D_OUT)
B_current: P7.2 U18.0(D_OUT)
C_current: P8.2 U19.0(D_OUT)
NetC4_2: DD1.C Q1.3(E) U17.1(C_IN) ; port E_A_UP, port A_UP
NetC21_2: DD2.C Q2.3(E) U18.1(C_IN) ; port E_B_UP, port B_UP
NetC35_2: DD3.C Q3.3(E) U19.1(C_IN) ; port E_C_UP, port C_UP
NetC44_2: C63.1 C64.1 C65.1 C68.1 C69.1 C70.1 C71.1 C72.1 C73.1 C74.1 C75.1 C76.1 DD1.A DD2.A DD3.A P2.3 Q4.3(E) Q5.3(E) Q6.3(E) ; port Cathode, port E_A_DOWN, port E_B_DOWN, port E_C_DOWN
NetC63_2: C63.2 C65.2 C69.2 C71.2 C73.2 C76.2 D46.1(K) D47.1(K) D48.1(K) D49.1(K) D50.1(K) D51.1(K) DD4.C DD5.C DD6.C P2.1 Q1.2(C) Q2.2(C) Q3.2(C) R53.2 R54.2 R55.2 R56.2 R57.2 R58.2 ; port Anode, port C_A_UP, port C_B_UP, port C_C_UP
NetC64_2: C64.2 D46.3(A) R53.1
NetC68_2: C68.2 D48.3(A) R55.1
NetC70_2: C70.2 D49.3(A) R56.1
NetC72_2: C72.2 D50.3(A) R57.1
NetC74_2: C74.2 D51.3(A) R58.1
NetC75_2: C75.2 D47.3(A) R54.1
NetD3_2: Q1.1(G) ; port G_A_UP
NetD11_2: Q2.1(G) ; port G_B_UP
NetD22_2: Q3.1(G) ; port G_C_UP
NetD28_2: DD4.A P3.3 Q4.2(C) ; port C_A_DOWN, port A_DOWN
NetD29_2: Q4.1(G) ; port G_A_DOWN
NetD35_2: DD5.A P4.3 Q5.2(C) ; port C_B_DOWN, port B_DOWN
NetD36_2: Q5.1(G) ; port G_B_DOWN
NetD41_2: DD6.A P5.3 Q6.2(C) ; port C_C_DOWN, port C_DOWN
NetD42_2: Q6.1(G) ; port G_C_DOWN
NetP3_1: P3.1 U17.5(C_OUT) ; port A_UP_1
NetP4_1: P4.1 U18.5(C_OUT) ; port B_UP_1
NetP5_1: P5.1 U19.5(C_OUT) ; port C_UP_1

Not connected (* = marked no-connect by the designer): P2 2; P3 2; P4 2; P5 2

### Library data of the parts
C63-C65 C68-C76 C79 C80 C83 C87-C89 = Cap: Capacitor; Published: 8-Jun-2000; LatestRevisionDate: 17-Jul-2002; LatestRevisionNote: Re-released for DXP Platform.; PackageReference: RAD-0.3; Publisher: Altium Limited
C77 C78 C81 C82 C86 C90 = Cap Pol1: Polarized Capacitor (Radial); Published: 8-Jun-2000; LatestRevisionDate: 17-Jul-2002; LatestRevisionNote: Re-released for DXP Platform.; PackageReference: RB7.6-15; Publisher: Altium Limited
D46-D51 DD1-DD6 = Diode 1N4148: High Conductance Fast Diode; Published: 8-Jun-2000; LatestRevisionDate: 17-Jul-2002; LatestRevisionNote: Re-released for DXP Platform.; DatasheetVersion: 1997; PackageReference: DO-35; Publisher: Altium Limited; Code_JEDEC: DO-204-AH; ComponentLink1Description: Manufacturer Link; ComponentLink1URL: http://www.fairchildsemi.com/; ComponentLink2Description: Datasheet; ComponentLink2URL: http://www.fairchildsemi.com/ds/1N%2F1N4148.pdf
P2-P8 = Header 3: Header, 3-Pin; LatestRevisionDate: 17-Jul-2002; LatestRevisionNote: Re-released for DXP Platform.; Publisher: Altium Limited
Q1-Q6 = IGBT-N: Insulated Gate Bipolar Transistor (N-Channel); Published: 8-Jun-2000; LatestRevisionDate: 17-Jul-2002; LatestRevisionNote: Re-released for DXP Platform.; DatasheetVersion: PD-9.684A; PackageReference: TO-247; Publisher: Altium Limited; Code_JEDEC: TO-247-AC; ComponentLink1Description: Manufacturer Link; ComponentLink1URL: http://www.irf.com/
R53-R58 = Res2: Resistor; Published: 8-Jun-2000; LatestRevisionDate: 17-Jul-2002; LatestRevisionNote: Re-released for DXP Platform.; PackageReference: AXIAL-0.4; Publisher: Altium Limited; Value: 5.2R

## Nets that join several sheets
+5V: driveII (21 pins), driveIII (18 pins)
+15V: driveII (16 pins), driveIII (9 pins)
+24V: driveII (7 pins), driveIII (5 pins)
GND: driveII (33 pins), driveIII (43 pins)
NetC4_2: driveII (5 pins), main1 (DD1.C Q1.3 U17.1)
NetC21_2: driveII (5 pins), main1 (DD2.C Q2.3 U18.1)
NetC35_2: driveII (5 pins), main1 (DD3.C Q3.3 U19.1)
NetC44_2: driveIII (15 pins), main1 (19 pins)
NetC63_2: driveII (D2.2 D10.2 D20.2), main1 (25 pins)
NetCON1_2: driveII (D6.1 U1.4), driveIII (CON1.2)
NetCON1_6: driveII (R8.1 U3.6), driveIII (CON1.6)
NetCON1_8: driveII (R17.1 U7.6), driveIII (CON1.8)
NetCON1_12: driveII (R30.1 U10.6), driveIII (CON1.12)
NetCON1_18: driveII (D15.1 U5.4), driveIII (CON1.18)
NetCON1_26: driveII (D25.1 U8.4), driveIII (CON1.26)
NetD3_2: driveII (D3.2 R1.2 R2.2), main1 (Q1.1)
NetD11_2: driveII (D11.2 R10.2 R11.2), main1 (Q2.1)
NetD22_2: driveII (D22.2 R19.2 R23.2), main1 (Q3.1)
NetD28_2: driveIII (D28.2), main1 (DD4.A P3.3 Q4.2)
NetD29_2: driveIII (D29.2 R31.2 R32.2), main1 (Q4.1)
NetD35_2: driveIII (D35.2), main1 (DD5.A P4.3 Q5.2)
NetD36_2: driveIII (D36.2 R39.2 R40.2), main1 (Q5.1)
NetD41_2: driveIII (D41.2), main1 (DD6.A P5.3 Q6.2)
NetD42_2: driveIII (D42.2 R46.2 R47.2), main1 (Q6.1)